# EAGLE design main_ver1.0 (EAGLE 7.2.0)
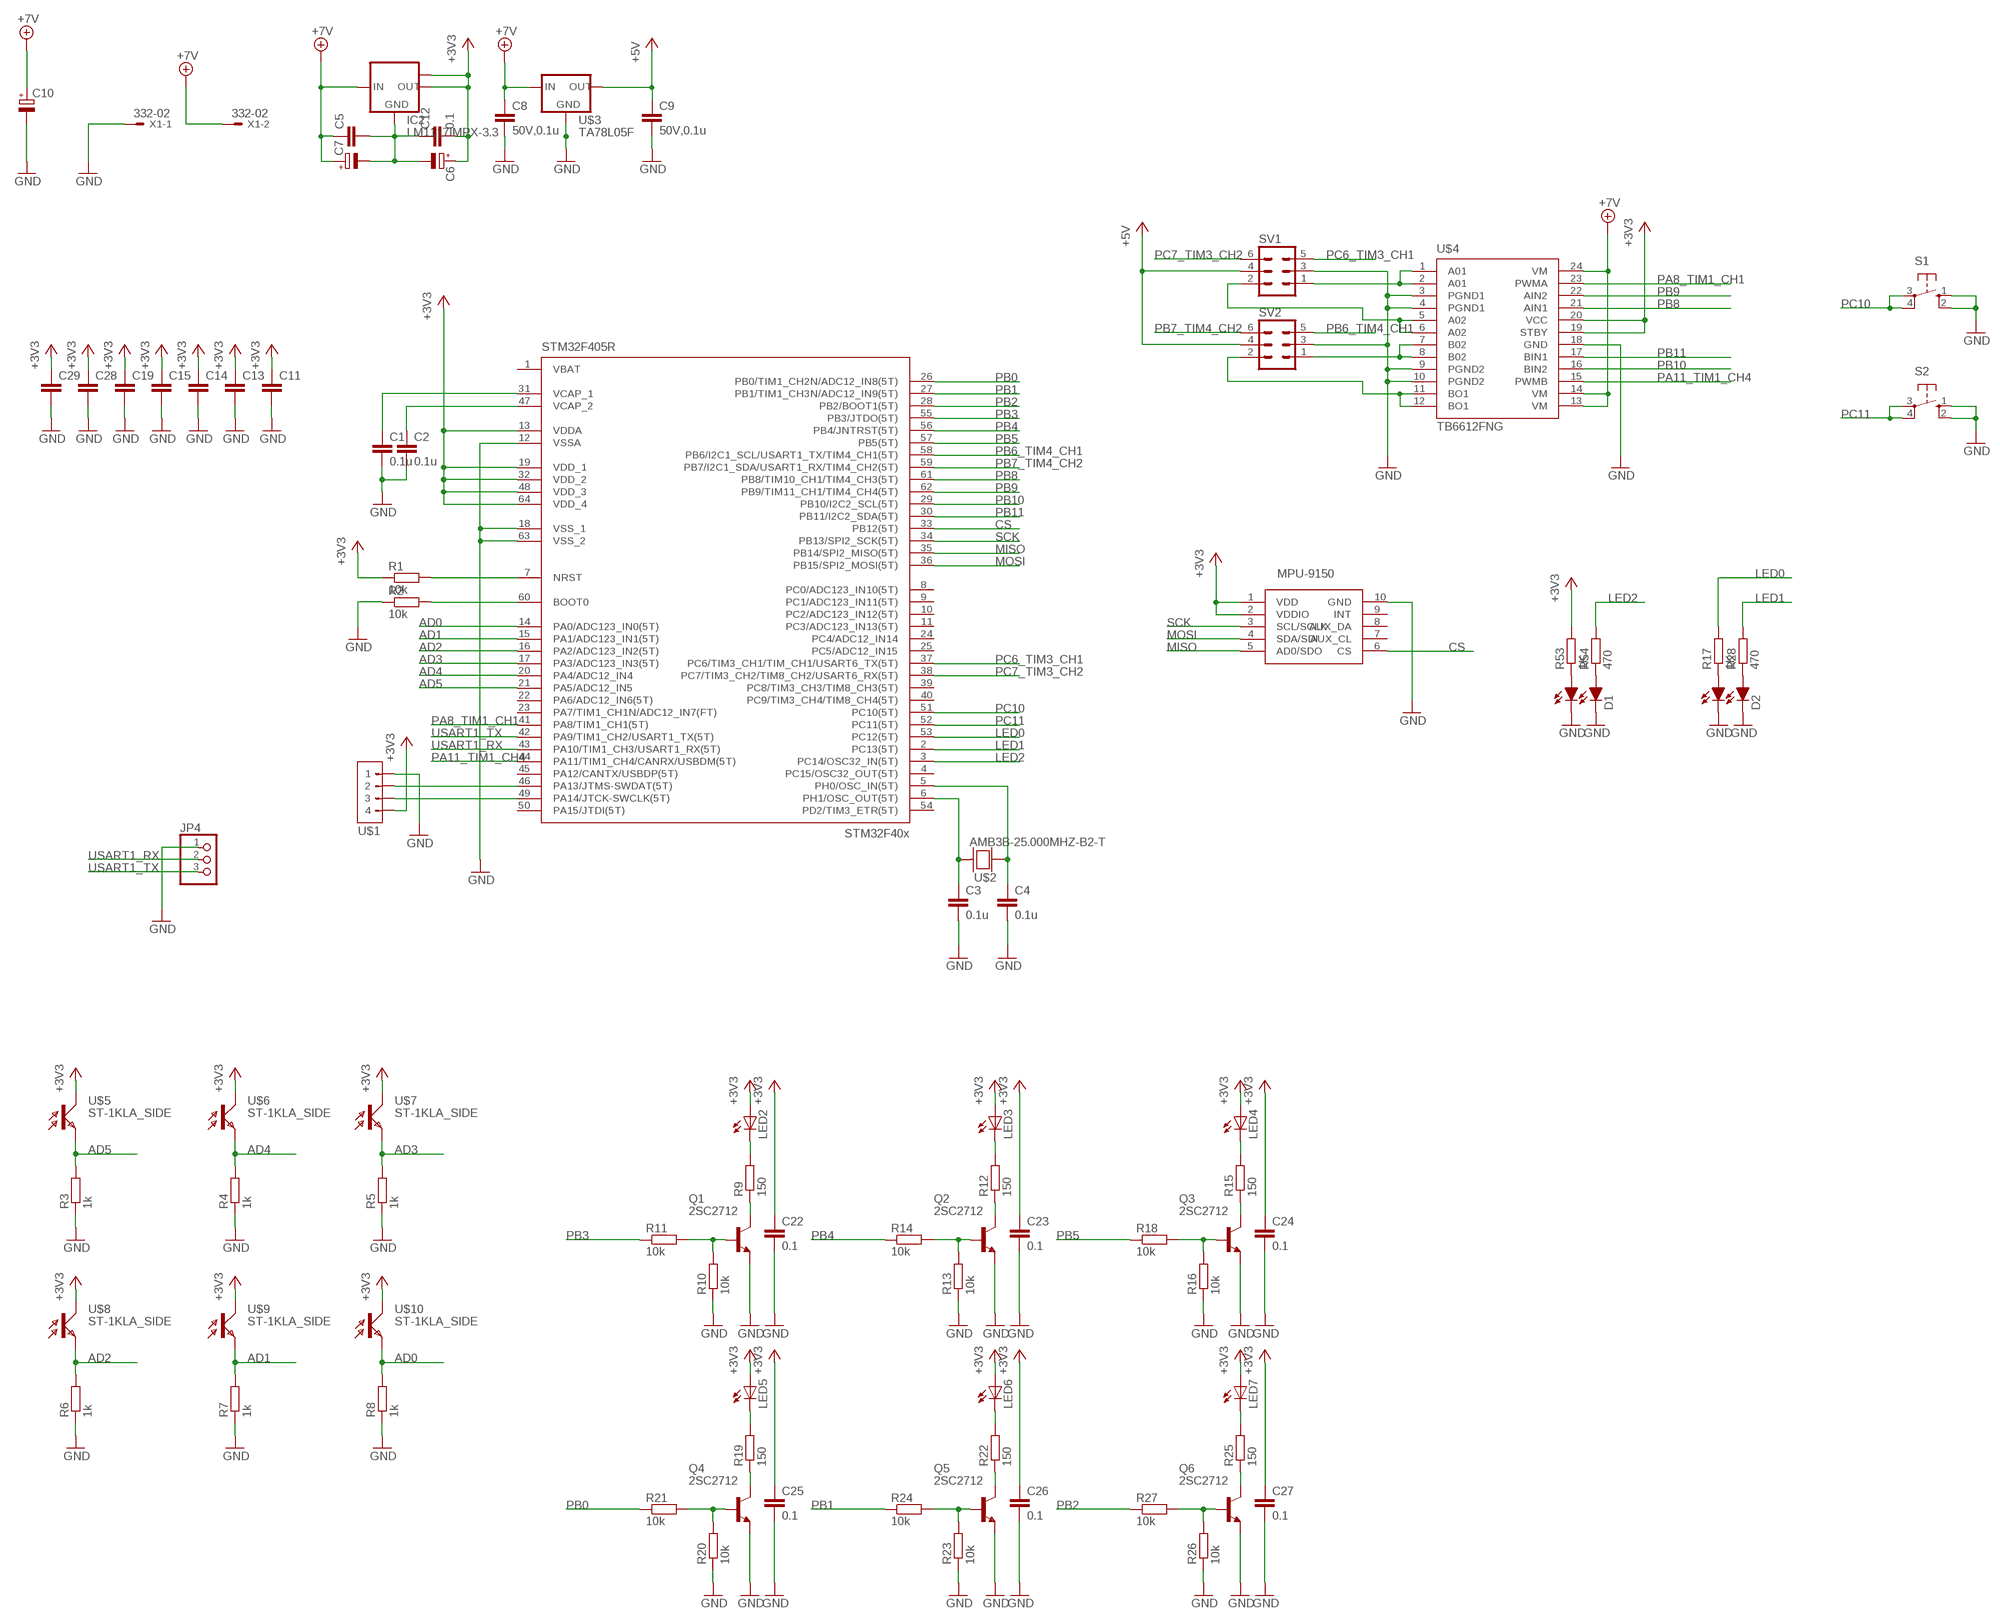
[diagram p0: schematic, sheet 1]

## Parts
C1  0.1u  C-EUC0603K  [C0603K]
C2  0.1u  C-EUC0603K  [C0603K]
C3  0.1u  C-EUC0603K  [C0603K]
C4  0.1u  C-EUC0603K  [C0603K]
C5  C-EUC0603  [C0603]
C6  CPOL-EUSANYO_SMD_A5  [SANYO-OSCON_SMD_A5]
C7  CPOL-EUSANYO_SMD_A5  [SANYO-OSCON_SMD_A5]
C8  50V,0.1u  C-EUC0603K  [C0603K]
C9  50V,0.1u  C-EUC0603K  [C0603K]
C10  CPOL-EUSANYO_SMD_A5  [SANYO-OSCON_SMD_A5]
C11  C-EUC0603K  [C0603K]
C12  0.1  C-EUC0603  [C0603]
C13  C-EUC0603K  [C0603K]
C14  C-EUC0603K  [C0603K]
C15  C-EUC0603K  [C0603K]
C19  C-EUC0603K  [C0603K]
C22  0.1  C-EUC0603  [C0603]
C23  0.1  C-EUC0603  [C0603]
C24  0.1  C-EUC0603  [C0603]
C25  0.1  C-EUC0603  [C0603]
C26  0.1  C-EUC0603  [C0603]
C27  0.1  C-EUC0603  [C0603]
C28  C-EUC0603K  [C0603K]
C29  C-EUC0603K  [C0603K]
D1  SEC2XX4  [LED3025]
D2  SEC2XX4  [LED3025]
IC2  LM1117IMPX-3.3  [SOT223]
JP4  PINHD-1X3/90  [1X03/90]
LED2  LEDSFH480  [SFH480]
LED3  LEDSFH480  [SFH480]
LED4  LEDSFH480  [SFH480]
LED5  LEDSFH480  [SFH480]
LED6  LEDSFH480  [SFH480]
LED7  LEDSFH480  [SFH480]
MPU-9250  MPU-9250  [MPU-9250]
Q1  2SC2712  [SC-59(TYPE1)]
Q2  2SC2712  [SC-59(TYPE1)]
Q3  2SC2712  [SC-59(TYPE1)]
Q4  2SC2712  [SC-59(TYPE1)]
Q5  2SC2712  [SC-59(TYPE1)]
Q6  2SC2712  [SC-59(TYPE1)]
R1  10k  R-EU_R0603  [R0603]
R2  10k  R-EU_R0603  [R0603]
R3  1k  R-EU_R0603  [R0603]
R4  1k  R-EU_R0603  [R0603]
R5  1k  R-EU_R0603  [R0603]
R6  1k  R-EU_R0603  [R0603]
R7  1k  R-EU_R0603  [R0603]
R8  1k  R-EU_R0603  [R0603]
R9  150  R-EU_R0603  [R0603]
R10  10k  R-EU_R0603  [R0603]
R11  10k  R-EU_R0603  [R0603]
R12  150  R-EU_R0603  [R0603]
R13  10k  R-EU_R0603  [R0603]
R14  10k  R-EU_R0603  [R0603]
R15  150  R-EU_R0603  [R0603]
R16  10k  R-EU_R0603  [R0603]
R17  1K  R-EU_R0603  [R0603]
R18  10k  R-EU_R0603  [R0603]
R19  150  R-EU_R0603  [R0603]
R20  10k  R-EU_R0603  [R0603]
R21  10k  R-EU_R0603  [R0603]
R22  150  R-EU_R0603  [R0603]
R23  10k  R-EU_R0603  [R0603]
R24  10k  R-EU_R0603  [R0603]
R25  150  R-EU_R0603  [R0603]
R26  10k  R-EU_R0603  [R0603]
R27  10k  R-EU_R0603  [R0603]
R28  470  R-EU_R0603  [R0603]
R53  1K  R-EU_R0603  [R0603]
R54  470  R-EU_R0603  [R0603]
S1  10-XX  [B3F-10XX]
S2  10-XX  [B3F-10XX]
STM32F405R  STM32F405R  [TQFP64]
SV1  ML6  [ML6]
SV2  ML6  [ML6]
U$1  TOP_TYPE_4PIN  [TOP_TYPE_4PIN]
U$2  AMB3B-25.000MHZ-B2-T  [4LCC]
U$3  TA78L05F  [SOT89]
U$4  TB6612FNG  [SSOP24]
U$5  ST-1KLA_SIDE  [TO18-SIDE]
U$6  ST-1KLA_SIDE  [TO18-SIDE]
U$7  ST-1KLA_SIDE  [TO18-SIDE]
U$8  ST-1KLA_SIDE  [TO18-SIDE]
U$9  ST-1KLA_SIDE  [TO18-SIDE]
U$10  ST-1KLA_SIDE  [TO18-SIDE]
X1  332-02  [332-02]

## Nets
+3V3: C6.+ C11.1 C12.2 C13.1 C14.1 C15.1 C19.1 C22.1 C23.1 C24.1 C25.1 C26.1 C27.1 C28.1 C29.1 IC2.2(OUT) IC2.TAB(OUT1) LED2.A LED3.A LED4.A LED5.A LED6.A LED7.A MPU-9250.1(VDD) MPU-9250.2(VDDIO) R1.1 R53.2 STM32F405R.13(VDDA) STM32F405R.19(VDD_1) STM32F405R.32(VDD_2) STM32F405R.48(VDD_3) STM32F405R.64(VDD_4) U$1.4 U$4.19(STBY) U$4.20(VCC) U$5.P$2(C) U$6.P$2(C) U$7.P$2(C) U$8.P$2(C) U$9.P$2(C) U$10.P$2(C)
+5V: C9.1 SV1.4 SV2.4 U$3.1(OUT)
+7V: C5.1 C7.+ C8.1 C10.+ IC2.3(IN) U$3.3(IN) U$4.13(VM) U$4.14(VM) U$4.24(VM) X1.2
AD0: R8.2 STM32F405R.14(PA0/ADC123_IN0(5T)) U$10.P$1(E)
AD1: R7.2 STM32F405R.15(PA1/ADC123_IN1(5T)) U$9.P$1(E)
AD2: R6.2 STM32F405R.16(PA2/ADC123_IN2(5T)) U$8.P$1(E)
AD3: R5.2 STM32F405R.17(PA3/ADC123_IN3(5T)) U$7.P$1(E)
AD4: R4.2 STM32F405R.20(PA4/ADC12_IN4) U$6.P$1(E)
AD5: R3.2 STM32F405R.21(PA5/ADC12_IN5) U$5.P$1(E)
CS: MPU-9250.6(CS) STM32F405R.33(PB12(5T))
GND: C1.2 C2.2 C3.2 C4.2 C5.2 C6.- C7.- C8.2 C9.2 C10.- C11.2 C12.1 C13.2 C14.2 C15.2 C19.2 C22.2 C23.2 C24.2 C25.2 C26.2 C27.2 C28.2 C29.2 D1.1(C0) D1.2(C1) D2.1(C0) D2.2(C1) IC2.1(GND) JP4.1 MPU-9250.10(GND) Q1.E Q2.E Q3.E Q4.E Q5.E Q6.E R2.1 R3.1 R4.1 R5.1 R6.1 R7.1 R8.1 R10.1 R13.1 R16.1 R20.1 R23.1 R26.1 S1.1(S) S1.2(S1) S2.1(S) S2.2(S1) STM32F405R.12(VSSA) STM32F405R.18(VSS_1) STM32F405R.63(VSS_2) SV1.3 SV2.3 U$1.1 U$3.2(GND) U$3.2@1(GND1) U$4.3(PGND1) U$4.4(PGND1) U$4.9(PGND2) U$4.10(PGND2) U$4.18(GND) X1.1
LED0: R17.2 STM32F405R.53(PC12(5T))
LED1: R28.2 STM32F405R.2(PC13(5T))
LED2: R54.2 STM32F405R.3(PC14/OSC32_IN(5T))
MISO: MPU-9250.5(AD0/SDO) STM32F405R.35(PB14/SPI2_MISO(5T))
MOSI: MPU-9250.4(SDA/SDI) STM32F405R.36(PB15/SPI2_MOSI(5T))
N$1: R1.2 STM32F405R.7(NRST)
N$2: R2.2 STM32F405R.60(BOOT0)
N$3: STM32F405R.49(PA14/JTCK-SWCLK(5T)) U$1.3
N$4: STM32F405R.46(PA13/JTMS-SWDAT(5T)) U$1.2
N$5: C2.1 STM32F405R.47(VCAP_2)
N$6: C1.1 STM32F405R.31(VCAP_1)
N$7: C4.1 STM32F405R.5(PH0/OSC_IN(5T)) U$2.1
N$8: C3.1 STM32F405R.6(PH1/OSC_OUT(5T)) U$2.3
N$9: SV2.1 U$4.7(B02) U$4.8(B02)
N$10: SV2.2 U$4.11(BO1) U$4.12(BO1)
N$11: SV1.2 U$4.5(A02) U$4.6(A02)
N$12: SV1.1 U$4.1(A01) U$4.2(A01)
N$13: D1.3(A1) R53.1
N$14: D2.3(A1) R17.1
N$15: D2.4(A0) R28.1
N$16: Q1.C R9.1
N$17: LED2.K(C) R9.2
N$19: Q2.C R12.1
N$20: Q2.B R13.2 R14.2
N$21: LED3.K(C) R12.2
N$22: Q3.C R15.1
N$23: Q3.B R16.2 R18.2
N$24: D1.4(A0) R54.1
N$25: LED4.K(C) R15.2
N$26: Q4.C R19.1
N$27: Q4.B R20.2 R21.2
N$28: LED5.K(C) R19.2
N$29: Q5.C R22.1
N$30: Q5.B R23.2 R24.2
N$31: LED6.K(C) R22.2
N$32: Q6.C R25.1
N$33: Q6.B R26.2 R27.2
N$34: LED7.K(C) R25.2
N$115: Q1.B R10.2 R11.2
PA8_TIM1_CH1: STM32F405R.41(PA8/TIM1_CH1(5T)) U$4.23(PWMA)
PA11_TIM1_CH4: STM32F405R.44(PA11/TIM1_CH4/CANRX/USBDM(5T)) U$4.15(PWMB)
PB0: R21.1 STM32F405R.26(PB0/TIM1_CH2N/ADC12_IN8(5T))
PB1: R24.1 STM32F405R.27(PB1/TIM1_CH3N/ADC12_IN9(5T))
PB2: R27.1 STM32F405R.28(PB2/BOOT1(5T))
PB3: R11.1 STM32F405R.55(PB3/JTDO(5T))
PB4: R14.1 STM32F405R.56(PB4/JNTRST(5T))
PB5: R18.1 STM32F405R.57(PB5(5T))
PB6_TIM4_CH1: STM32F405R.58(PB6/I2C1_SCL/USART1_TX/TIM4_CH1(5T)) SV2.5
PB7_TIM4_CH2: STM32F405R.59(PB7/I2C1_SDA/USART1_RX/TIM4_CH2(5T)) SV2.6
PB8: STM32F405R.61(PB8/TIM10_CH1/TIM4_CH3(5T)) U$4.21(AIN1)
PB9: STM32F405R.62(PB9/TIM11_CH1/TIM4_CH4(5T)) U$4.22(AIN2)
PB10: STM32F405R.29(PB10/I2C2_SCL(5T)) U$4.16(BIN2)
PB11: STM32F405R.30(PB11/I2C2_SDA(5T)) U$4.17(BIN1)
PC6_TIM3_CH1: STM32F405R.37(PC6/TIM3_CH1/TIM_CH1/USART6_TX(5T)) SV1.5
PC7_TIM3_CH2: STM32F405R.38(PC7/TIM3_CH2/TIM8_CH2/USART6_RX(5T)) SV1.6
PC10: S1.3(P) S1.4(P1) STM32F405R.51(PC10(5T))
PC11: S2.3(P) S2.4(P1) STM32F405R.52(PC11(5T))
SCK: MPU-9250.3(SCL/SCLK) STM32F405R.34(PB13/SPI2_SCK(5T))
USART1_RX: JP4.2 STM32F405R.43(PA10/TIM1_CH3/USART1_RX(5T))
USART1_TX: JP4.3 STM32F405R.42(PA9/TIM1_CH2/USART1_TX(5T))
Unconnected: MPU-9250.7(AUX_CL) MPU-9250.8(AUX_DA) MPU-9250.9(INT) STM32F405R.1(VBAT) STM32F405R.4(PC15/OSC32_OUT(5T)) STM32F405R.8(PC0/ADC123_IN10(5T)) STM32F405R.9(PC1/ADC123_IN11(5T)) STM32F405R.10(PC2/ADC123_IN12(5T)) STM32F405R.11(PC3/ADC123_IN13(5T)) STM32F405R.22(PA6/ADC12_IN6(5T)) STM32F405R.23(PA7/TIM1_CH1N/ADC12_IN7(FT)) STM32F405R.24(PC4/ADC12_IN14) STM32F405R.25(PC5/ADC12_IN15) STM32F405R.39(PC8/TIM3_CH3/TIM8_CH3(5T)) STM32F405R.40(PC9/TIM3_CH4/TIM8_CH4(5T)) STM32F405R.45(PA12/CANTX/USBDP(5T)) STM32F405R.50(PA15/JTDI(5T)) STM32F405R.54(PD2/TIM3_ETR(5T)) U$2.2(G1) U$2.4(G2)

## Library data of the parts
C1-C5 C8 C9 C11-C15 C19 C22-C29 = resistor:C-EU: CAPACITOR, European symbol
C6 C7 C10 = rcl:CPOL-EU: POLARIZED CAPACITOR, European symbol
D1 D2 = SRT162-010:SEC2XX4
IC2 = lm1117:LM1117IMPX-*
JP4 = pinhead:PINHD-1X3: PIN HEADER
LED2-LED7 = led:LED: LED OSRAM: - CHIPLED LG R971, LG N971, LY N971, LG Q971, LY Q971, LO R971, LY R971 LH N974, LH R974 LS Q976, LO Q976, LY Q976 LO Q996 - Hyper CHIPLED LW Q18S LB Q993, LB Q99A, LB R99A - SideLED LS A670, LO A670, LY A670, LG A670, LP A670 LB A673, LV A673, LT A673, LW A673 LH A674 LY A675 LS A676, LA A676, LO A676, LY A676, LW A676 LS A679, LY A679, LG A679 - Hyper Micro SIDELED® LS Y876, LA Y876, LO Y876, LY Y876 LT Y87S - SmartLED LW L88C, LW L88S LB L89C, LB L89S, LG L890 LS L89K, LO L89K, LY L89K LS L896, LA L896, LO L896, LY L896 - TOPLED LS T670, LO T670, LY T670, LG T670, LP T670 LSG T670, LSP T670, LSY T670, LOP T670, LYG T670 LG T671, LOG T671, LSG T671 LB T673, LV T673, LT T673, LW T673 LH T674 LS T676, LA T676, LO T676, LY T676, LB T676, LH T676, LSB T676, LW T676 LB T67C, LV T67C, LT T67C, LS T67K, LO T67K, LY T67K, LW E67C LS E67B, LA E67B, LO E67B, LY E67B, LB E67C, LV E67C, LT E67C LW T67C LS T679, LY T679, LG T679 LS T770, LO T770, LY T770, LG T770, LP T770 LB T773, LV T773, LT T773, LW T773 LH T774 LS E675, LA E675, LY E675, LS T675 LS T776, LA T776, LO T776, LY T776, LB T776 LHGB T686 LT T68C, LB T68C - Hyper Mini TOPLED® LB M676 - Mini TOPLED Santana® LG M470 LS M47K, LO M47K, LY M47K Source: http://www.osram.convergy.de LUXEON: - LUMILED® LXK2-PW12-R00, LXK2-PW12-S00, LXK2-PW14-U00, LXK2-PW14-V00 LXK2-PM12-R00, LXK2-PM12-S00, LXK2-PM14-U00 LXK2-PE12-Q00, LXK2-PE12-R00, LXK2-PE12-S00, LXK2-PE14-T00, LXK2-PE14-U00 LXK2-PB12-K00, LXK2-PB12-L00, LXK2-PB12-M00, LXK2-PB14-N00, LXK2-PB14-P00, LXK2-PB14-Q00 LXK2-PR12-L00, LXK2-PR12-M00, LXK2-PR14-Q00, LXK2-PR14-R00 LXK2-PD12-Q00, LXK2-PD12-R00, LXK2-PD12-S00 LXK2-PH12-R00, LXK2-PH12-S00 LXK2-PL12-P00, LXK2-PL12-Q00, LXK2-PL12-R00 Source: www.luxeon.com KINGBRIGHT: KA-3528ASYC Source: www.kingbright.com
MPU-9250 = MPU-9250:MPU-9250
Q1-Q6 = Transistor:2SC2712
R1-R28 R53 R54 = resistor:R-EU_: RESISTOR, European symbol
S1 S2 = switch-omron:10-XX: OMRON SWITCH; MPN: B3F-1000; OC_FARNELL: 176432; OC_NEWARK: 36M3542
STM32F405R = stm32f4:STM32F405R: STM32F405 64 pin LQFP reviewed: YES tested: YES
SV1 SV2 = con-ml:ML6: HARTING; OC_FARNELL: unknown; OC_NEWARK: unknown
U$1 = GHconnector:TOP_TYPE_4PIN
U$2 = stm32f4:AMB3B-25.000MHZ-B2-T: CRYSTAL, 25.000MHZ 18PF SMD reviewed: YES tested: YES
U$3 = v-reg:TA78L05F
U$4 = TB6612FNG:TB6612FNG
U$5-U$10 = kodenshi:ST-1KLA_SIDE
X1 = con-garry:332-02: 2 Pin - 2mm Dual Row Source: www.mpe-connector.de / garry_shortform_2012.pdf

## Board
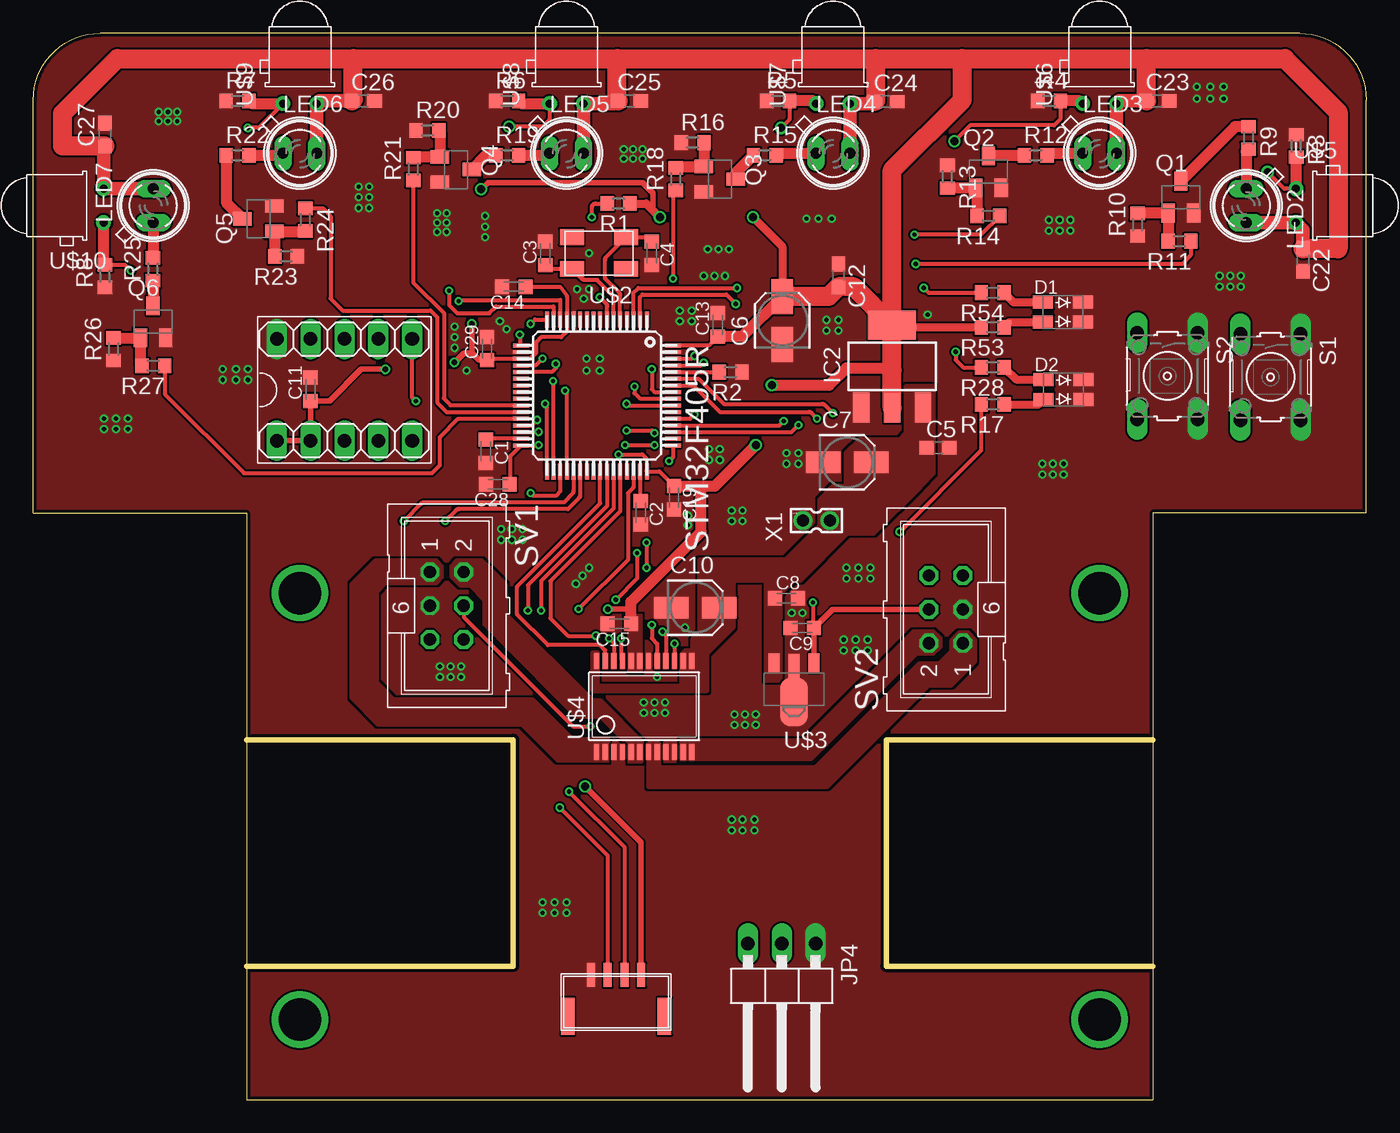
[diagram p1: board, top side]
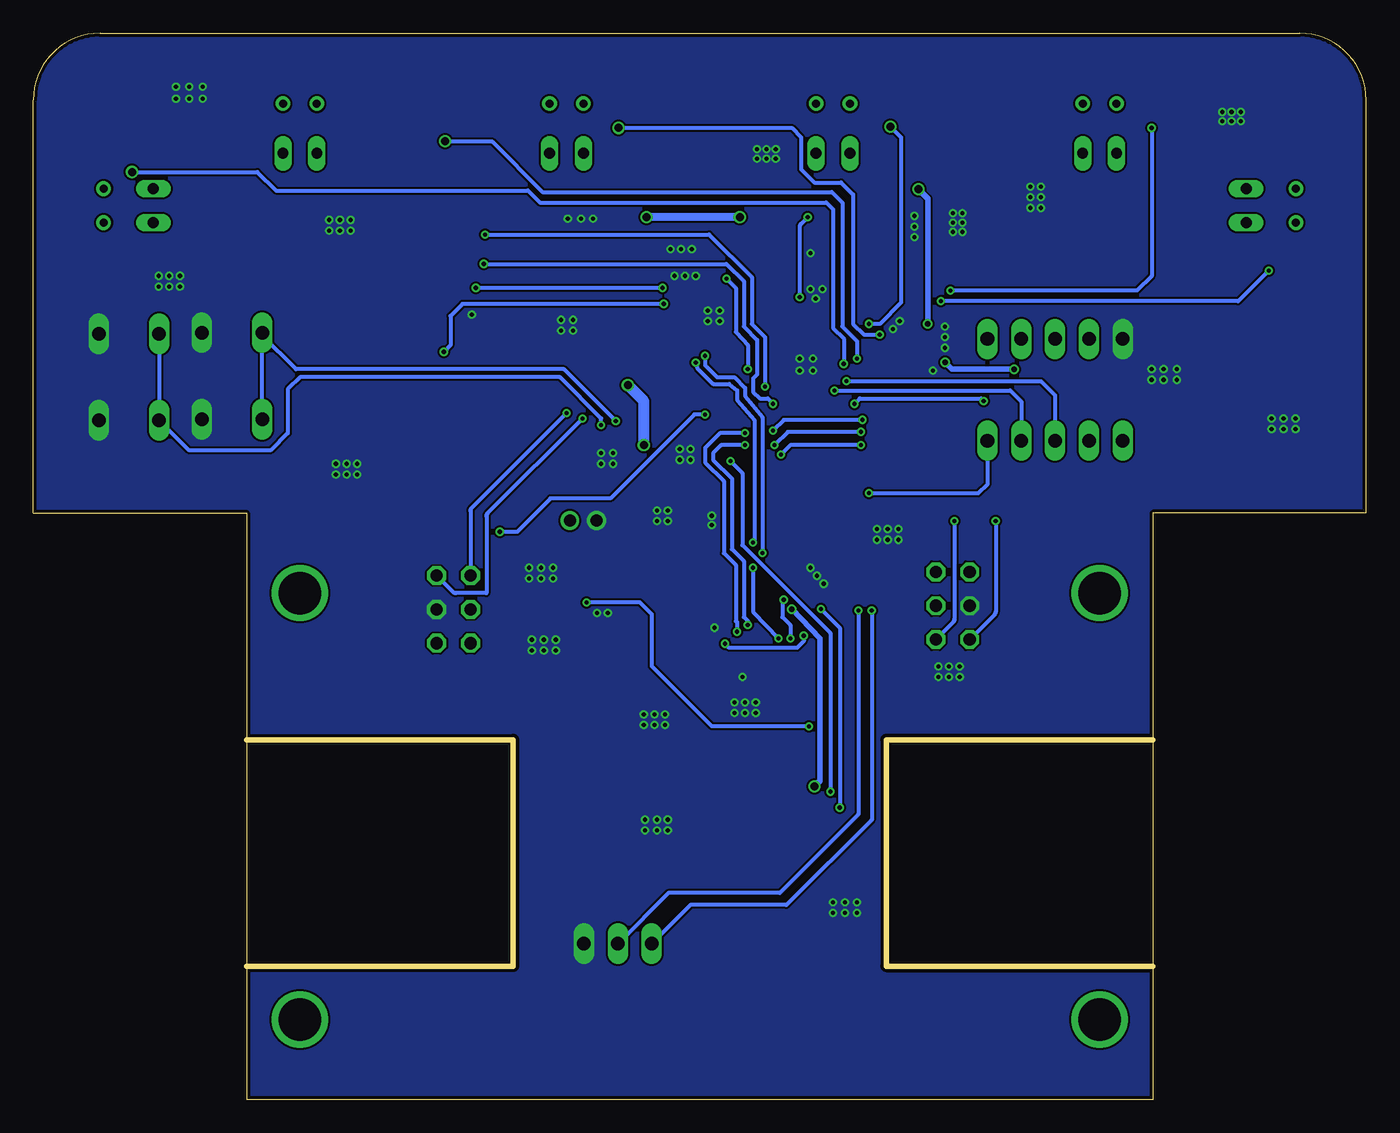
[diagram p2: board, bottom side, seen from below]

Size 100 x 80 mm. Coordinates in mm from the lower left corner, seen from the top.
Outline: 16,27 16,44 0,44 0,75 arc-90 5,80 95,80 arc-90 100,75 100,44 84,44 84,27
Outline: 16,27 16,10
Outline: 16,10 16,0 84,0 84,10
Outline: 84,27 84,10
Outline: 84,27 64,27 64,10 84,10
Outline: 16,27 36,27 36,10 16,10
Copper layers (1*16): Top 0.035mm / dielectric 1.5mm / Bottom 0.035mm
Design rules "default *": minimum track width 6mil, minimum drill 12mil, track to track 6mil, track to pad 6mil, pad to pad 6mil, via to via 6mil, smd to smd 0mil, copper to edge 10mil, drill to drill 10mil, minimum pad ring 10mil, minimum via ring 6mil, stop-mask expansion 2mil, vias tented up to drill 100mil, thermal gap 10mil
tKeepout: 16 lines
bKeepout: 16 lines

### Footprints (pad centres in the part's own frame; a part is rotated, then mirrored left to right if it is on the bottom)
C0603K = smd 1.05 x 1.08: 1 -0.875,0; 2 0.875,0
C0603 = smd 1.1 x 1: 1 -0.85,0; 2 0.85,0
SANYO-OSCON_SMD_A5 = smd 2.6 x 1.6: + 1.8,0; - -1.8,0
LED3025 = smd 1.5 x 1: 1 1.5,0.75; 2 1.5,-0.75; 3 -1.5,-0.75; 4 -1.5,0.75
SOT223 = smd 1.219 x 2.235: 1 -2.311,-3.099; 2 0,-3.099; 3 2.311,-3.099 | smd 3.6 x 2.2: TAB 0,3.099
1X03/90 = drill 1.016 long: 1 -2.54,-3.81; 2 0,-3.81; 3 2.54,-3.81
SFH480 = drill 0.813 long: A 1.27,0; K -1.27,0
MPU-9250 = drill 1.016 long: 1 -3.81,5.08; 2 -3.81,2.54; 3 -3.81,0; 4 -3.81,-2.54; 5 -3.81,-5.08; 6 3.81,-5.08; 7 3.81,-2.54; 8 3.81,0; 9 3.81,2.54; 10 3.81,5.08
SC-59(TYPE1) = smd 1 x 1.4: B -0.95,-1.2; C 0,1.2; E 0.95,-1.2
R0603 = smd 1 x 1.1: 1 -0.85,0; 2 0.85,0
B3F-10XX = drill 1.016 long: 1 -3.251,2.261; 2 3.251,2.261; 3 -3.251,-2.261; 4 3.251,-2.261
TQFP64 = smd 1.2 x 0.3: 1 -5.7,3.75; 2 -5.7,3.25; 3 -5.7,2.75; 4 -5.7,2.25; 5 -5.7,1.75; 6 -5.7,1.25; 7 -5.7,0.75; 8 -5.7,0.25; 9 -5.7,-0.25; 10 -5.7,-0.75; 11 -5.7,-1.25; 12 -5.7,-1.75; 13 -5.7,-2.25; 14 -5.7,-2.75; 15 -5.7,-3.25; 16 -5.7,-3.75; 33 5.7,-3.75; 34 5.7,-3.25; 35 5.7,-2.75; 36 5.7,-2.25; 37 5.7,-1.75; 38 5.7,-1.25; 39 5.7,-0.75; 40 5.7,-0.25; 41 5.7,0.25; 42 5.7,0.75; 43 5.7,1.25; 44 5.7,1.75; 45 5.7,2.25; 46 5.7,2.75; 47 5.7,3.25; 48 5.7,3.75 | smd 0.3 x 1.2: 17 -3.75,-5.7; 18 -3.25,-5.7; 19 -2.75,-5.7; 20 -2.25,-5.7; 21 -1.75,-5.7; 22 -1.25,-5.7; 23 -0.75,-5.7; 24 -0.25,-5.7; 25 0.25,-5.7; 26 0.75,-5.7; 27 1.25,-5.7; 28 1.75,-5.7; 29 2.25,-5.7; 30 2.75,-5.7; 31 3.25,-5.7; 32 3.75,-5.7; 49 3.75,5.7; 50 3.25,5.7; 51 2.75,5.7; 52 2.25,5.7; 53 1.75,5.7; 54 1.25,5.7; 55 0.75,5.7; 56 0.25,5.7; 57 -0.25,5.7; 58 -0.75,5.7; 59 -1.25,5.7; 60 -1.75,5.7; 61 -2.25,5.7; 62 -2.75,5.7; 63 -3.25,5.7; 64 -3.75,5.7
ML6 = drill 0.914 octagon: 1 -2.54,-1.27; 2 -2.54,1.27; 3 0,-1.27; 4 0,1.27; 5 2.54,-1.27; 6 2.54,1.27
TOP_TYPE_4PIN = smd 0.6 x 1.8: 1 -1.875,2.025; 2 -0.625,2.025; 3 0.625,2.025; 4 1.875,2.025 | smd 1 x 2.8: P$1 -3.625,-1.075; P$2 3.625,-1.075
4LCC = smd 1.803 x 1.194: 1 -2.032,-1.194; 2 2.032,-1.194; 3 2.032,1.194; 4 -2.032,1.194
SOT89 = smd 0.8 x 1.4: 1 -1.499,-1.981; 3 1.499,-1.981 | smd 0.8 x 1.9: 2 0,-1.727 | smd 2.032 x 3.65: 2@1 0,0.94
SSOP24 = smd 0.4 x 1.2: 1 -3.575,-3.42; 2 -2.925,-3.42; 3 -2.275,-3.42; 4 -1.625,-3.42; 5 -0.975,-3.42; 6 -0.325,-3.42; 7 0.325,-3.42; 8 0.975,-3.42; 9 1.625,-3.42; 10 2.275,-3.42; 11 2.925,-3.42; 12 3.575,-3.42; 13 3.575,3.42; 14 2.925,3.42; 15 2.275,3.42; 16 1.625,3.42; 17 0.975,3.42; 18 0.325,3.42; 19 -0.325,3.42; 20 -0.975,3.42; 21 -1.625,3.42; 22 -2.275,3.42; 23 -2.925,3.42; 24 -3.575,3.42
TO18-SIDE = drill 0.6: P$1 -1.27,-1.27; P$2 1.27,-1.27
332-02 = drill 0.9 pad 1.27: 1 0,-1; 2 0,1

### Placement (x,y rotation side)
C1  33.96,48.63 270 top
C2  45.58,44.03 270 top
C3  38.41,63.49 90 top
C4  46.39,63.5 270 top
C5  67.87,48.89 0 top
C6  56.19,58.45 90 top
C7  61.07,47.81 0 top
C8  56.5,37.62 0 top
C9  57.69,35.38 180 top
C10  49.67,36.91 0 top
C11  20.8,53.3 90 top
C12  60.4,61.83 270 top
C13  51.35,58.12 90 top
C14  36.04,60.99 180 top
C15  43.96,35.69 180 top
C19  48.07,45.15 270 top
C22  95.25,62.99 270 top
C23  84.36,74.93 0 top
C24  63.96,74.87 0 top
C25  44.72,74.93 0 top
C26  24.75,74.93 0 top
C27  5.38,72.4 90 top
C28  34.86,46.17 180 top
C29  34.04,56.35 90 top
D1  77.25,59.08 0 top
D2  77.29,53.27 0 top
IC2  64.43,55.01 0 top
JP4  56.15,7.89 180 top
LED2  91,67.07 270 top
LED3  80,71 0 top
LED4  60,71 0 top
LED5  40,71 0 top
LED6  20,71 0 top
LED7  9,67.07 90 top
MPU-9250  23.34,53.25 90 top
Q1  86.09,67.71 0 top
Q2  71.66,69.61 0 top
Q3  51.51,69.06 270 top
Q4  31.71,69.78 270 top
Q5  16.89,66.08 90 top
Q6  8.98,58.36 0 top
R1  43.91,67.23 180 top
R2  52.32,54.58 180 top
R3  94.75,71.55 270 top
R4  76.2,74.93 0 top
R5  55.88,74.93 0 top
R6  35.56,74.93 0 top
R7  15.32,74.93 0 top
R8  5.38,61.78 90 top
R9  91.17,72.15 270 top
R10  82.85,65.63 90 top
R11  85.99,64.4 180 top
R12  75.2,70.85 0 top
R13  68.58,69.23 270 top
R14  71.66,66.3 180 top
R15  54.88,70.85 0 top
R16  49.47,71.8 0 top
R17  71.98,52.16 180 top
R18  48.2,69.06 90 top
R19  35.56,70.85 0 top
R20  29.57,72.72 0 top
R21  28.5,69.82 90 top
R22  15.32,70.85 0 top
R23  18.97,63.26 180 top
R24  20.4,66.02 270 top
R25  8.98,62.29 90 top
R26  6.02,56.29 90 top
R27  9.01,55.06 180 top
R28  71.98,54.93 180 top
R53  71.98,57.94 180 top
R54  71.98,60.54 180 top
S1  92.82,54.21 270 top
S2  85.09,54.29 270 top
STM32F405R  42.28,52.83 270 top
SV1  31.02,37.05 270 top
SV2  68.47,36.78 90 top
U$1  43.72,7.32 0 top
U$2  42.44,63.52 180 top
U$3  57.07,30.77 180 top
U$4  45.83,29.5 0 top
U$5  96,67.07 270 top
U$6  80,76 0 top
U$7  60,76 0 top
U$8  40,76 0 top
U$9  20,76 0 top
U$10  4,67.07 90 top
X1  58.75,43.44 270 top

### Tracks (layer width: path | path; a pad name or v marks a point on that pad's centre or on a via)
+3V3  (via drill 0.3, 0.41, 0.6)
  Top 0.305: C13.1 50.69,56.58 STM32F405R.64 | C14.1 39.51,60.99 40.03,60.27 STM32F405R.13 40.03,57.63 39.6,57.2 38.1,57.2 37.7,56.8 37.7,56 37.28,55.58 STM32F405R.19 34.15,55.58 C29.1 | C28.1 35.8,46.1 | 35.8,46.1 | 35.8,46.1 35.8,48.3 STM32F405R.32 37.88,49.08 v37.9,49.1 | C19.1 46.97,47.13 STM32F405R.48 46,47.16 46,48.1 45.7,48.4 v43.9,48.4
  Top 0.406: U$1.4 45.59,19.3 v41.4,23.5 | v43.1,36.8 44.84,36.8 | C29.1 33.42,55.48 32.9,56 | 32.9,56 v32.9,58.2 | v33.6,68.3 34.1,68.8 45.7,68.8 46.5,68 46.5,66.7 46.65,66.55 | MPU-9250.1 MPU-9250.2 C11.1 22.23,52.42 24.6,54.8 v26.4,54.8 | 32.9,56 32.3,56 v31.6,55.3
  Top 0.61: IC2.TAB 64.6,57.94 R53.2 | R1.1 45.97,67.23 46.65,66.55 v47,66.2 | v54,66.2 56.19,64.01 C6.+
  Top 0.813: C6.+ 53.19,57.24 C13.1 | C19.1 50.1,46.02 | 50.1,46.02 51.12,46.02 v54.2,49.1 | v55.4,53.6 59.7,53.6 61,54.9 64.23,54.9 64.43,54.7 | C15.1 44.84,36.8 44.84,37.34 50.1,42.6 50.1,46.02
  Top 1.016: C27.1 5.27,71.44 U$10.P$2 LED7.A | C26.1 21.47,74.93 U$9.P$2 LED6.A | 43.8,75 43.53,74.73 U$8.P$2 LED5.A | C24.1 62.97,74.73 U$7.P$2 LED4.A | C23.1 81.47,74.93 U$6.P$2 LED3.A | C22.1 95.25,65.28 U$5.P$2 LED2.A
  Top 1.422: IC2.2 64.43,54.7 IC2.TAB | IC2.TAB 64.43,69.73 69.7,75 69.7,78.1 | 69.7,78.1 83.51,78.1 | 83.51,78.1 93.9,78.1 97.9,74.1 97.9,63.84 C22.1 | C23.1 83.51,78.1 | C27.1 2.2,71.55 2.2,74 6.3,78.1 24,78.1 | 24,78.1 43.8,78.1 | 43.8,78.1 63.2,78.1 | 63.2,78.1 69.7,78.1 | C26.1 24,75.03 24,78.1 | C25.1 43.8,75 43.8,78.1 | C24.1 63.2,74.96 63.2,78.1 | IC2.TAB 61.56,60.98 C12.2 59.67,60.25 C6.+
  Bottom 0.305: v37.9,49.1 43.2,49.1 v43.9,48.4
  Bottom 0.406: v41.4,23.5 41,23.9 41,34.6 v43.1,36.8 | v32.9,58.2 32.9,67.6 v33.6,68.3 | v31.6,55.3 31.1,54.8 v26.4,54.8
  Bottom 0.61: v47,66.2 v54,66.2
  Bottom 0.813: v54.2,49.1 54.2,52.4 v55.4,53.6
  pour Top (no thermals): 44.7,32.2 45.6,32.2 45.6,36.3 44.7,36.3
+5V  (via drill 0.3)
  Top 0.305: SV1.4 32.29,36.21 40.5,28 v41.8,28 | v58.5,37.3 58.5,35.45 C9.1
  Top 0.406: U$3.1 C9.1 59.97,36.78 SV2.4
  Bottom 0.305: v41.8,28 49.1,28 53.6,32.5 53.6,36.4 54.5,37.3 v58.5,37.3
+7V
  pour Top (no thermals): 50,40.5 50,35 49.5,34.5 49.5,31 42.3,31 42.3,33.5 42,33.5 42,30.7 50.5,30.7 50.5,33.5 52.5,35.5 52.5,39 57,39 57,40.5
  pour Top (no thermals): 61,44.5 61,42.5 57.5,39 57,39 56,38 56,31.5 55,31.5 55,38 55,39 59,43 59,44.5
  pour Top (no thermals): 59,42.5 59,45 60,46 61,46 61,48.5 62,49.5 65,49.5 65.5,50 65.5,53.5 67.5,53.5 67.5,48 67.5,47 66.5,46 63,42.5
  pour Top (no thermals): 49.7,33.7 48.9,33.7 48.6,33.4 48.6,30.9 49.7,30.9
AD0  (via drill 0.3)
  Top 0.305: R8.2 6.87,62.63 v7.3,62.2 | v31.9,59.9 32,60 39.53,60 STM32F405R.14
  Top 0.813: R8.2 5.27,62.74 U$10.P$1
  Bottom 0.305: v7.3,62.2 9.6,59.9 v31.9,59.9
AD1  (via drill 0.3)
  Top 0.305: U$9.P$1 16.9,72.9 v16.1,72.9 | v31.2,60.7 31.2,59.6 31.8,59 34.2,59 34.7,59.5 39.03,59.5 STM32F405R.15
  Top 0.813: R7.2 16.37,74.73 U$9.P$1
  Bottom 0.305: v16.1,72.9 16.1,61.8 17.2,60.7 v31.2,60.7
AD2  (via drill 0.3, 0.6)
  Top 0.305: U$8.P$1 38.73,73.53 38.2,73 v35.7,73 | v37.3,58.2 37.63,58.53 STM32F405R.16
  Top 0.813: R6.2 36.61,74.73 U$8.P$1
  Bottom 0.305: v35.7,73 34.9,72.2 34.9,59.8 36.5,58.2 v37.3,58.2
AD3  (via drill 0.3, 0.6)
  Top 0.305: R5.2 56.73,73.53 v56.1,72.9 | v36.5,57.4 36.5,56.66 STM32F405R.17
  Top 0.813: U$7.P$1 58.53,74.93 R5.2
  Bottom 0.305: v56.1,72.9 43.1,72.9 42.4,72.2 42.4,69.8 41.4,68.8 39.4,68.8 38.5,67.9 38.5,58.2 37.7,57.4 v36.5,57.4
AD4  (via drill 0.3, 0.6)
  Top 0.305: R4.2 77.05,73.55 76.6,73.1 70.3,73.1 v69.1,71.9 | 36.6,55.1 STM32F405R.20 37.68,55.08 v38.2,55.6
  Top 0.813: U$6.P$1 78.53,74.93 R4.2
  Bottom 0.305: v69.1,71.9 65.6,71.9 61.8,68.1 40.1,68.1 39.3,67.3 39.3,58 38.2,56.9 v38.2,55.6
AD5  (via drill 0.3, 0.6)
  Top 0.305: U$5.P$1 93.86,68.34 v92.6,69.6 | v39.2,55.2 39.2,54.9 38.9,54.6 36.6,54.6 STM32F405R.21
  Top 0.813: U$5.P$1 94.75,68.36 R3.2
  Bottom 0.305: v92.6,69.6 83.2,69.6 81.8,68.2 62.9,68.2 62,67.3 40.5,67.3 40,66.8 40,57.9 39.2,57.1 v39.2,55.2
CS  (via drill 0.3)
  Top 0.305: STM32F405R.33 38.53,52.07 v38.4,52.2 | v28.7,52.4 28.42,52.68 MPU-9250.6
  Bottom 0.305: v38.4,52.2 38,52.6 28.9,52.6 v28.7,52.4
GND  (via drill 0.3)
  other vias: 5.3,51.1 6.2,51.1 7.1,51.1 5.3,50.3 6.2,50.3 7.1,50.3 14.2,54.8 15.2,54.8 16.1,54.8 14.2,54 15.2,54 16.1,54 24.4,68.5 25.2,68.5 25.2,67.7 25.2,66.9 24.4,66.9 24.4,67.7 33.9,66.3 33.9,65.5 33.9,64.7 41.7,63.5 40.8,60.8 41.7,60.8 41.3,60.1 35,58.4 35.5,57.8 41.5,55.6 42.5,55.6 41.5,54.7 42.5,54.7 48.5,59.2 49.4,59.2 49.4,58.4 48.5,58.4 58,66.1 58.9,66.1 59.9,66.1 59.5,58.5 60.4,58.5 59.5,57.7 60.4,57.7 76.2,66 77,66 77.8,66 76.2,65.2 77,65.2 77.8,65.2 87.3,76 88.3,76 89.3,76 89.3,75.1 88.3,75.1 87.3,75.1 89,61.8 89.8,61.8 90.6,61.8 90.6,61 89.8,61 89,61 77.3,47.7 77.3,46.9 76.5,47.7 76.5,46.9 75.7,47.7 75.7,46.9 53.2,44.2 53.2,43.4 52.4,43.4 52.4,44.2 61,39.9 61.9,39.9 61,39.1 61.9,39.1 62.8,39.9 62.8,39.1 60.8,34.5 61.7,34.5 62.6,34.5 60.8,33.7 61.7,33.7 62.6,33.7 56.9,36.5 57.7,36.5 48.9,35.4 46.6,29.8 45.8,29.8 47.4,29.8 45.8,29 46.6,29 47.4,29 30.5,32.5 31.3,32.5 32.1,32.5 30.5,31.7 31.3,31.7 32.1,31.7 52.4,21 53.2,21 54.1,21 52.4,20.2 53.2,20.2 54.1,20.2 40.7,38.7 41.2,39.3 41.7,39.9 31.6,58 31.6,57.2 31.6,56.4 46.8,31.7 49.1,43.8 49.1,43.1 56.5,48.5 57.4,48.5 56.5,47.7 57.4,47.7 50.3,61.8 51.1,61.8 51.9,61.8 50.7,48.8 51.5,48.8 50.7,48 51.5,48 32.5,54.7 9.4,74.1 10.1,74.1 10.8,74.1 9.4,73.4 10.1,73.4 10.8,73.4 30.3,66.5 31,66.5 30.3,65.8 31,65.8 30.3,65.1 31,65.1 44.3,71.3 45,71.3 45.7,71.3 44.3,70.6 45,70.6 45.7,70.6 50.6,63.8 51.4,63.8 52.2,63.8 67.1,58.9 35.1,42.8 35.9,42.8 36.7,42.8 36.7,42 35.9,42 35.1,42 52.6,28.9 53.4,28.9 54.2,28.9 52.6,28.1 53.4,28.1 54.2,28.1 38.2,14.8 39.1,14.8 40,14.8 38.2,14 39.1,14 40,14
  pour Top (rank 6, no thermals): -16.9,85.1 103,85.1 103,-4.4 -16.9,-4.4
  pour Bottom (rank 6, no thermals): -2.1,88.2 118.6,88.2 118.6,-10.4 -2.1,-10.4
LED0  (via drill 0.3)
  Top 0.305: STM32F405R.53 49.28,51.08 v49.6,51.4 | v65,42.6 71.13,48.73 R17.2
  Bottom 0.305: v49.6,51.4 50.4,51.4 56.7,45.1 61.2,45.1 63.7,42.6 v65,42.6
LED1  (via drill 0.3)
  Top 0.305: STM32F405R.2 45.53,60.23 45.7,60.4 52,60.4 v52.7,59.7 | v69.2,56.1 69.2,55.5 69.77,54.93 R28.2
  Bottom 0.305: v52.7,59.7 67.8,59.7 68.7,58.8 68.7,56.6 v69.2,56.1
LED2  (via drill 0.3)
  Top 0.305: STM32F405R.3 45.03,60.53 45.4,60.9 v52.8,60.9 | v66.8,60.9 67.16,60.54 R54.2
  Bottom 0.305: v52.8,60.9 v66.8,60.9
MISO  (via drill 0.3)
  Top 0.305: STM32F405R.35 39.53,45.63 39.2,45.3 37.5,45.3 v37.3,45.5
  Bottom 0.305: v37.3,45.5 29.1,45.5 28.4,46.2 28.4,49.42 MPU-9250.5
MOSI  (via drill 0.3)
  Top 0.305: STM32F405R.36 40.03,53.07 v39.9,53.2
  Bottom 0.305: v39.9,53.2 26.7,53.2 25.88,52.38 MPU-9250.4
N$1  (via drill 0.3)
  Top 0.305: STM32F405R.7 arc45 43.04,58.55 arc45 43.06,58.6 43.06,59.51 arc45 42.97,59.73 v42.5,60.2 | v41.9,66.2 41.9,66.91 arc-90 42.22,67.23 R1.2
  Bottom 0.305: v42.5,60.2 42.5,65.47 arc45 42.41,65.69 v41.9,66.2
N$2
  Top 0.305: STM32F405R.60 R2.2
N$3  (via drill 0.3)
  Top 0.305: STM32F405R.49 47.98,48.18 v47.7,47.9 | v40.2,23.1 44.34,18.95 U$1.3
  Bottom 0.305: v47.7,47.9 46.8,47 46.8,41.6 40.2,35 v40.2,23.1
N$4  (via drill 0.3)
  Top 0.305: STM32F405R.46 45.03,45.93 44.6,45.5 44.6,40.5 v40.9,36.8 | v39.5,21.9 43.09,18.3 U$1.2
  Bottom 0.305: v40.9,36.8 39.5,35.4 v39.5,21.9
N$5
  Top 0.305: STM32F405R.47 45.53,44.95 C2.1
N$6
  Top 0.305: STM32F405R.31 34.14,49.58 arc45 C1.1
N$7
  Top 0.305: STM32F405R.5 44.03,60.34 arc45 43.94,60.56 42.9,61.6 42.9,63.01 arc-45 42.99,63.23 U$2.1 45.92,64.71 arc-45 46.14,64.62 C4.1
N$8
  Top 0.305: C3.1 38.61,62.42 arc45 38.83,62.33 U$2.3 41.14,61.59 arc45 41.37,61.5 42.3,61.5 43.44,60.36 arc-45 43.53,60.14 STM32F405R.6
N$9
  pour Top (no thermals): 46.9,26.7 46.9,24.9 58.7,24.9 66.5,32.7 68,32.7 68.9,33.6 68.9,34.4 69.5,35 70.1,35 70.6,34.5 70.6,32.9 68.8,31.1 67.1,31.1 59.5,23.5 46.2,23.5 46.2,26.7
N$10
  pour Top (no thermals): 48.6,26.7 48.6,25.6 49.8,25.6 58.3,25.6 61.3,28.6 66.2,33.5 67.5,33.5 68,34 68,34.6 67.5,35.1 66.8,35.1 66.1,35.1 58.2,27.2 57.9,26.9 48.6,26.9
N$11
  pour Top (no thermals): 44.7,25.4 45.6,25.4 45.6,26.8 42.5,29.9 41.9,29.9 35.4,36.4 35.4,38.6 33.6,40.4 31.8,40.4 31.4,40 31.4,39.3 32.1,38.6 32.8,38.6 33.9,37.5 33.9,36.5 33.9,35.7 34.9,34.7 40.8,28.8 41.2,28.8 42.6,28.8 44.7,26.7
N$12
  pour Top (no thermals): 43.1,25.5 39.4,25.5 36.7,28.2 25.9,28.2 23.9,30.2 23.9,38.6 25.7,40.4 30.2,40.4 30.6,40 30.6,39.2 30.2,38.8 26.4,38.8 25.7,38.1 25.7,31.3 27,30 37.4,30 40.4,27 43.1,27
N$13
  Top 0.61: R53.1 73.22,58.33 D1.3
N$14
  Top 0.61: R17.1 75.43,52.16 D2.3
N$15
  Top 0.61: R28.1 73.74,54.02 D2.4
N$16
  Top 0.813: R9.1 90.18,73 Q1.C
N$17
  Top 0.813: R9.2 91,71.13 LED2.K
N$18  (via drill 3.2)
  other vias: 20,38
N$19
  Top 0.813: Q2.C 71.7,70.85 R12.1
N$20
  Top 0.813: R13.2 68.61,68.41 Q2.B 70.81,68.31 R14.2
N$21
  Top 0.813: R12.2 76.2,71 LED3.K
N$22
  Top 0.813: R15.1 52.71,69.53 Q3.C
N$23
  Top 0.813: R16.2 Q3.B 48.3,70.01 R18.2
N$24
  Top 0.61: R54.1 73.54,59.83 D1.4
N$25
  Top 0.813: R15.2 55.88,71 LED4.K
N$26
  Top 0.813: Q4.C 33.98,70.85 R19.1
N$27
  Top 0.813: R20.2 30.51,72.63 Q4.B 28.56,70.73 R21.2
N$28
  Top 0.813: R19.2 38.58,70.85 LED5.K
N$29
  Top 0.813: R22.1 14.47,67.3 Q5.C
N$30
  Top 0.813: R23.2 18.09,63.29 Q5.B 20.36,65.13 R24.2
N$31
  Top 0.813: R22.2 18.58,70.85 LED6.K
N$32
  Top 0.813: R25.1 Q6.C
N$33
  Top 0.813: R27.2 8.03,55.19 Q6.B 8.01,57.14 R26.2
N$34
  Top 0.813: LED7.K 9,63.16 R25.2
N$35  (via drill 3.2)
  other vias: 20,6
N$36  (via drill 3.2)
  other vias: 80,38
N$37  (via drill 3.2)
  other vias: 80,6
N$115
  Top 0.813: R10.2 82.88,66.51 Q1.B R11.2
PA8_TIM1_CH1
  Top 0.305: U$4.23 42.91,33.7 42.5,34.1 38.6,34.1 36.3,36.4 36.3,38.5 42.53,44.73 STM32F405R.41
PA11_TIM1_CH4  (via drill 0.3)
  Top 0.305: STM32F405R.44 44.03,44.13 38.8,38.9 38.8,36.1 40.1,34.8 v42.2,34.8 | v48.1,34.2 U$4.15
  Bottom 0.305: v42.2,34.8 42.2,34.4 42.7,33.9 47.8,33.9 v48.1,34.2
PB0
  Top 0.305: R21.1 28.5,61.3 30.8,59 30.8,52.6 31.3,52.1 36.56,52.1 STM32F405R.26
PB1
  Top 0.305: R24.1 21.73,66.87 22.3,66.3 22.3,60.1 23.2,59.2 29.8,59.2 30.3,58.7 30.3,52.3 31.02,51.58 STM32F405R.27
PB2
  Top 0.305: R27.1 9.86,52.94 15.8,47 29.9,47 30.5,47.6 30.5,49.7 31.88,51.08 STM32F405R.28
PB3  (via drill 0.3)
  Top 0.305: R11.1 86.84,63.34 86.2,62.7 v66.2,62.7 | v44.5,52.2 44.62,52.08 STM32F405R.55
  Bottom 0.305: v66.2,62.7 48,62.7 46.7,61.4 46.7,58 45.7,57 45.7,54.4 46,54.1 46,53.1 45.5,52.6 44.9,52.6 v44.5,52.2
PB4  (via drill 0.3)
  Top 0.305: R14.1 71.11,64.9 v66.1,64.9 | v45.1,53.5 45.1,53 45.5,52.6 47.96,52.6 STM32F405R.56
  Bottom 0.305: v66.1,64.9 49.3,64.9 46.1,61.7 46.1,58.2 45.1,57.2 v45.1,53.5
PB5  (via drill 0.3)
  Top 0.305: R18.1 48,68.01 v48,61.6 | v46.4,54.8 46.4,53.3 46.6,53.1 47.96,53.1 STM32F405R.57
  Bottom 0.305: v46.4,54.8 46.4,56.6 47.3,57.6 47.3,60.9 v48,61.6
PB6_TIM4_CH1  (via drill 0.3)
  Top 0.305: STM32F405R.58 49.39,53.58 arc-45 49.61,53.49 51.5,51.6 58.17,51.6 arc-45 58.39,51.51 v58.8,51.1
  Bottom 0.305: v58.8,51.1 65.91,43.99 arc-45 66,43.77 66,38 68.29,38 arc45 68.51,38.09 SV2.5
PB7_TIM4_CH2  (via drill 0.3)
  Top 0.305: STM32F405R.59 49.79,54.08 arc-45 50.01,53.99 51.8,52.2 59.17,52.2 arc-45 59.39,52.11 v60,51.5
  Bottom 0.305: v60,51.5 67.11,44.39 arc-45 67.2,44.17 SV2.6
PB8  (via drill 0.3)
  Top 0.305: STM32F405R.61 50.08,55.08 v50.3,55.3 | v46,41.8 v46,39.9 | v44.1,34.6 44.1,33.02 U$4.21
  Bottom 0.305: v50.3,55.3 50.2,54.9 49,53.7 47.8,53.7 47.2,53.2 47.2,52.5 45.9,51 45.9,41.9 v46,41.8 | v46,39.9 46,36.6 v44.1,34.6
PB9  (via drill 0.3)
  Top 0.305: STM32F405R.62 49.38,55.58 v49.6,55.8 | v45.3,41 45.3,39.1 v43.7,37.5 | 43.6,32.97 arc-90 U$4.22 43.55,34.24 v43.2,34.6
  Bottom 0.305: v49.6,55.8 49.6,55.1 48.7,54.2 47.4,54.2 46.6,53.4 46.6,52.8 45.3,51.2 v45.3,41 | v43.7,37.5 43.8,37.4 43.8,36.2 43.2,35.6 v43.2,34.6
PB10  (via drill 0.3)
  Top 0.305: STM32F405R.29 37.38,50.58 v37.8,51 | v44.5,50.2 46.4,50.2 v46.6,50 | v47.2,35.1 47.45,34.84 U$4.16
  Bottom 0.305: v37.8,51 43.7,51 v44.5,50.2 | v46.6,50 48.5,50 49.6,48.9 49.6,47.8 48.2,46.4 48.2,41 47.3,40.1 47.3,35.9 47.2,35.8 v47.2,35.1
PB11  (via drill 0.3)
  Top 0.305: STM32F405R.30 37.9,50.08 v37.9,50.1 | v44.4,49.1 v46.6,49.1 | v46.4,35.6 46.4,34.6 46.8,34.2 U$4.17
  Bottom 0.305: v37.9,50.1 43.4,50.1 v44.4,49.1 | v46.6,49.1 48.4,49.1 49,48.5 49,48 47.6,46.6 47.6,41.3 46.7,40.4 46.7,36.2 46.4,35.9 v46.4,35.6
PC6_TIM3_CH1  (via drill 0.3)
  Top 0.305: STM32F405R.37 40.53,45.66 arc-45 40.44,45.44 39.8,44.8 29.33,44.8 arc45 29.11,44.71 v27.8,43.4
  Bottom 0.305: v27.8,43.4 27.8,36.59 arc45 27.89,36.37 SV1.5
PC7_TIM3_CH2  (via drill 0.3)
  Top 0.305: STM32F405R.38 41.03,45.36 arc-45 40.94,45.14 40.1,44.3 31.93,44.3 arc45 31.71,44.21 v30.9,43.4
  Bottom 0.305: v30.9,43.4 30.9,36.03 arc45 30.99,35.81 SV1.6
PC10  (via drill 0.3)
  Top 0.305: STM32F405R.51 56.88,50.08 v57.4,50.6
  Bottom 0.305: v57.4,50.6 57.4,51.1 60.5,54.2 80,54.2 80.9,53.3 80.9,50 82.2,48.7 88.3,48.7 S1.4 S1.3
PC11  (via drill 0.3)
  Top 0.305: STM32F405R.52 55.98,50.58 v56.3,50.9
  Bottom 0.305: v56.3,50.9 60.2,54.8 80.3,54.8 82.83,57.33 S2.3 S2.4
SCK  (via drill 0.3)
  Top 0.305: STM32F405R.34 39.03,53.87 v39,53.9
  Bottom 0.305: v39,53.9 24.4,53.9 23.34,52.84 MPU-9250.3
USART1_RX  (via drill 0.3)
  Top 0.305: STM32F405R.43 43.53,44.33 38.1,38.9 v38.1,36.7
  Bottom 0.305: v38.1,36.7 38.1,21.4 44,15.5 52.35,15.5 JP4.2
USART1_TX  (via drill 0.3)
  Top 0.305: STM32F405R.42 43.03,44.53 37.1,38.6 v37.1,36.7
  Bottom 0.305: v37.1,36.7 37.1,21 43.5,14.6 50.71,14.6 JP4.3